# EAGLE design w18-CV-v03(rev5_6) (EAGLE 6.6.0)
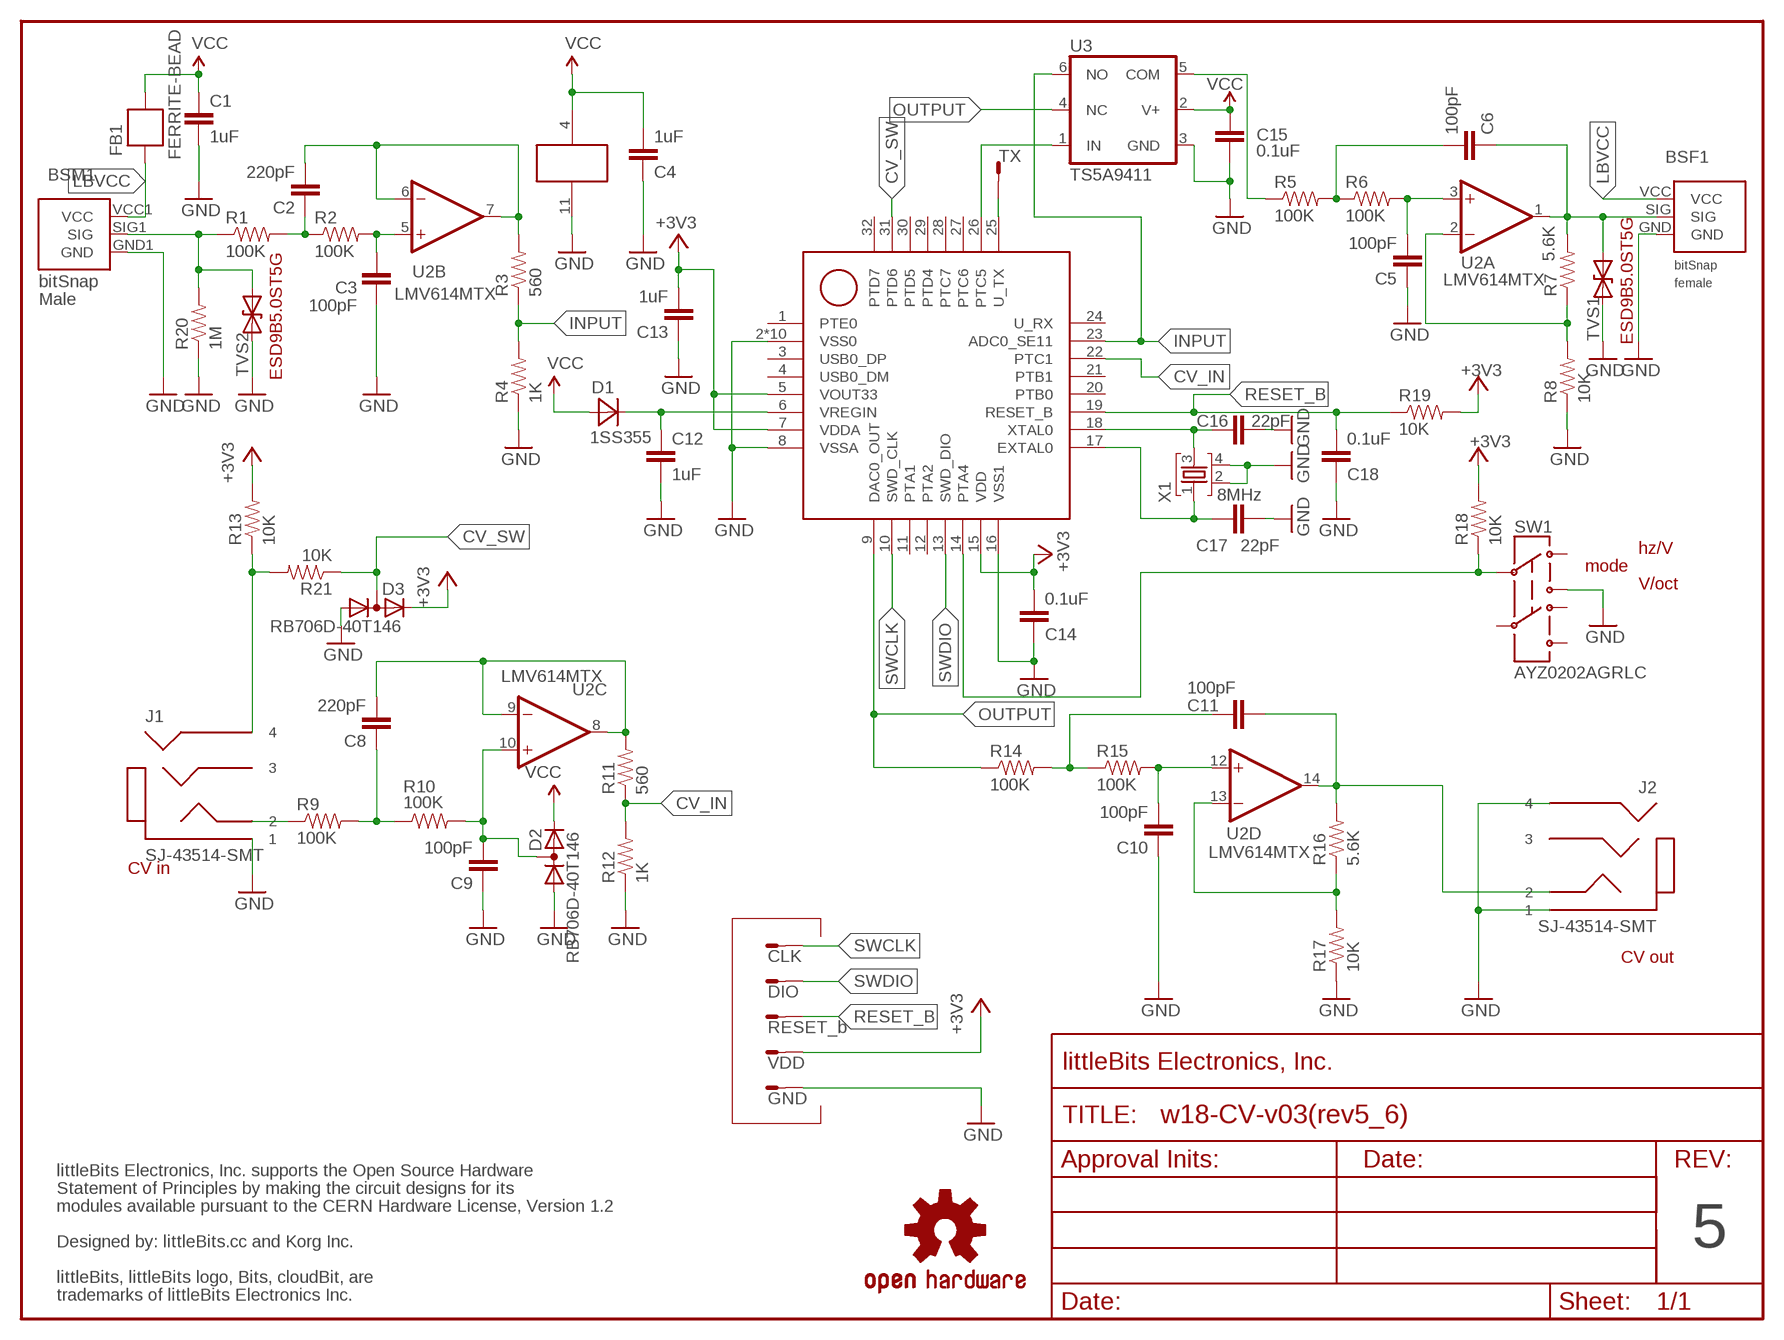
[diagram p0: schematic, sheet 1]

## Parts
BSF1  BITSNAP_V03_FEMALE  [BITSNAP_V03_FEMALE]
BSM1  BITSNAP_V03_MALE  [BITSNAP_V03_MALE]
C1  1uF  CC_1608_0.8_TBR_LB_1  [CC_1608_0.8_TBR_LB_1PRIMARY]
C2  220pF  CC_1608_0.8_TBR_LB_1  [CC_1608_0.8_TBR_LB_1PRIMARY]
C3  100pF  CC_1608_0.8_TBR_LB_1  [CC_1608_0.8_TBR_LB_1PRIMARY]
C4  1uF  CC_1608_0.8_TBR_LB_1  [CC_1608_0.8_TBR_LB_1PRIMARY]
C5  100pF  CC_1608_0.8_TBR_LB_1  [CC_1608_0.8_TBR_LB_1PRIMARY]
C6  100pF  CC_1608_0.8_TBR_LB_1  [CC_1608_0.8_TBR_LB_1PRIMARY]
C8  220pF  CC_1608_0.8_TBR_LB_1  [CC_1608_0.8_TBR_LB_1PRIMARY]
C9  100pF  CC_1608_0.8_TBR_LB_1  [CC_1608_0.8_TBR_LB_1PRIMARY]
C10  100pF  CC_1608_0.8_TBR_LB_1  [CC_1608_0.8_TBR_LB_1PRIMARY]
C11  100pF  CC_1608_0.8_TBR_LB_1  [CC_1608_0.8_TBR_LB_1PRIMARY]
C12  1uF  CC_1608_0.8_TBR_LB_1  [CC_1608_0.8_TBR_LB_1PRIMARY]
C13  1uF  CC_1608_0.8_TBR_LB_1  [CC_1608_0.8_TBR_LB_1PRIMARY]
C14  0.1uF  CC_1608_0.8_TBR_LB_1  [CC_1608_0.8_TBR_LB_1PRIMARY]
C15  0.1uF  CC_1608_0.8_TBR_LB_1  [CC_1608_0.8_TBR_LB_1PRIMARY]
C16  22pF  CC_1608_0.8_TBR_LB_1  [CC_1608_0.8_TBR_LB_1PRIMARY]
C17  22pF  CC_1608_0.8_TBR_LB_1  [CC_1608_0.8_TBR_LB_1PRIMARY]
C18  0.1uF  CC_1608_0.8_TBR_LB_1  [CC_1608_0.8_TBR_LB_1PRIMARY]
D1  1SS355  DISC_ROHM-UMD2_#_TBR_LB_1  [DISC_ROHM-UMD2_#_TBR_LB_1PRIMARY]
D2  RB706D-40T146  DIODE_SERIES_A1-K2-AK3_  [SOT23C]
D3  RB706D-40T146  DIODE_SERIES_A1-K2-AK3_  [SOT23C]
FB1  FERRITE-BEAD  [R0603]
FRAME1  FRAME-LETTER-OHWOHW  [FABDWG01-OHW]
J1  SJ-43514-SMT  LB_K_CN_SJ-43514-SMT_LB  [LB_K_CN_SJ-43514-SMT_LB]
J2  SJ-43514-SMT  LB_K_CN_SJ-43514-SMT_LB  [LB_K_CN_SJ-43514-SMT_LB]
JP1  GND  TEST_POINT_1  [TEST_POINT_1PRIMARY]
JP2  VDD  TEST_POINT_1  [TEST_POINT_1PRIMARY]
JP3  RESET_b  TEST_POINT_1  [TEST_POINT_1PRIMARY]
JP4  DIO  TEST_POINT_1  [TEST_POINT_1PRIMARY]
JP5  CLK  TEST_POINT_1  [TEST_POINT_1PRIMARY]
JP6  TX  TEST_POINT_1  [TEST_POINT_1PRIMARY]
R1  100K  R_1608_LB  [R_1608_LB]
R2  100K  R_1608_LB  [R_1608_LB]
R3  560  R_1608_LB  [R_1608_LB]
R4  1K  R_1608_LB  [R_1608_LB]
R5  100K  R_1608_LB  [R_1608_LB]
R6  100K  R_1608_LB  [R_1608_LB]
R7  5.6K  R_1608_LB  [R_1608_LB]
R8  10K  R_1608_LB  [R_1608_LB]
R9  100K  R_1608_LB  [R_1608_LB]
R10  100K  R_1608_LB  [R_1608_LB]
R11  560  R_1608_LB  [R_1608_LB]
R12  1K  R_1608_LB  [R_1608_LB]
R13  10K  R_1608_LB  [R_1608_LB]
R14  100K  R_1608_LB  [R_1608_LB]
R15  100K  R_1608_LB  [R_1608_LB]
R16  5.6K  R_1608_LB  [R_1608_LB]
R17  10K  R_1608_LB  [R_1608_LB]
R18  10K  R_1608_LB  [R_1608_LB]
R19  10K  R_1608_LB  [R_1608_LB]
R20  1M  R_1608_LB  [R_1608_LB]
R21  10K  R_1608_LB  [R_1608_LB]
SW1  AYZ0202AGRLC  SW_MS-22C01_#_TBR_LB_1  [SW_MS-22C01_#_TBR_LB_1PRIMARY]
TVS1  ESD9B5.0ST5G  DIODE-TVSSOD-923  [SOD-923]
TVS2  ESD9B5.0ST5G  DIODE-TVSSOD-923  [SOD-923]
U1  MKL26Z64VFM4  IC_TI-QFN32_0.5_TBR_LB_1  [IC_TI-QFN32_0.5_TBR_LB_1PRIMARY]
U2  LMV614MTX  IC_TSSOP14-225_0.65_TBR_LB_1  [IC_TSSOP14-225_0.65_TBR_LB_1PRIMARY]
U3  TS5A9411  IC_SSOP6-W2.1_0.65_TBR_LB_1  [IC_SSOP6-W2.1_0.65_TBR_LB_1PRIMARY]
U$1  OSHWCREDIT-KORG  [OSHWCREDIT-KORG]
U$5  OSHW-LOGOL  [OSHW-LOGO-L]
X1  8MHz  X_ROSON_RT5_#_TBR_LB_1  [X_ROSON_RT5_#_TBR_LB_1PRIMARY]

## Nets
+3V3: C13.2 C14.2 D3.2(K) JP2.1(S) R13.2 R18.2 R19.2 U1.5(VOUT33) U1.7(VDDA) U1.15(VDD)
CV_IN: R11.1 R12.2 U1.22(PTC1)
CV_SW: D3.3(AK) R21.1 U1.31(PTD6)
GND: BSF1.GND BSM1.GND1(GND) C1.2 C3.1 C4.1 C5.1 C9.1 C10.1 C12.2 C13.1 C14.1 C15.1 C16.1 C17.1 C18.1 D2.1(A) D3.1(A) J1.1 J2.1 J2.4 JP1.1(S) R4.1 R8.1 R12.1 R17.1 R20.1 SW1.3 TVS1.1(A) TVS2.1(A) U1.2(VSS0) U1.8(VSSA) U1.16(VSS1) U1.33(VSS0) U1.34(VSS0) U1.35(VSS0) U1.36(VSS0) U1.37(VSS0) U1.38(VSS0) U1.39(VSS0) U1.40(VSS0) U1.41(VSS0) U2.11(P:V-) U3.3(GND) X1.2 X1.4
INPUT: R3.1 R4.2 U1.23(ADC0_SE11) U3.6(NO)
JCK_DET: J1.4 R13.1 R21.2
LBVCC: BSF1.VCC BSM1.VCC1(VCC) FB1.2
N$1: BSM1.SIG1(SIG) R1.1 R20.2 TVS2.2(C)
N$2: C2.2 R3.2 U2.6(B:-IN) U2.7(B:OUT)
N$3: C3.2 R2.2 U2.5(B:+IN)
N$4: C2.1 R1.2 R2.1
N$5: R5.1 U3.5(COM)
N$6: BSF1.SIG C6.1 R7.2 TVS1.2(C) U2.1(A:OUT)
N$7: J1.2 R9.1
N$8: C12.1 D1.2 U1.6(VREGIN)
N$9: C6.2 R5.2 R6.1
N$10: C5.2 R6.2 U2.3(A:+IN)
N$11: R18.1 SW1.2 U1.14(PTA4)
N$12: C9.2 D2.3(AK) R10.2 U2.10(C:+IN)
N$13: C8.1 R9.2 R10.1
N$14: U1.26(PTC5) U3.1(IN)
N$15: C17.2 U1.17(EXTAL0) X1.1
N$16: C16.2 U1.18(XTAL0) X1.3
N$18: C11.2 R14.2 R15.1
N$19: C10.2 R15.2 U2.12(D:+IN)
N$20: R7.1 R8.2 U2.2(A:-IN)
N$21: C11.1 J2.2 R16.2 U2.14(D:OUT)
N$22: R16.1 R17.2 U2.13(D:-IN)
NETR: C8.2 R11.2 U2.8(C:OUT) U2.9(C:-IN)
OUTPUT: R14.1 U1.9(DAC0_OUT) U3.4(NC)
RESET_B: C18.2 JP3.1(S) R19.1 U1.19(RESET_B)
SWCLK: JP5.1(S) U1.10(SWD_CLK)
SWDIO: JP4.1(S) U1.13(SWD_DIO)
TX: JP6.1(S) U1.25(U_TX)
VCC: C1.1 C4.2 C15.2 D1.1 D2.2(K) FB1.1 U2.4(P:V+) U3.2(V+)
Unconnected: J1.3 J2.3 SW1.1 SW1.4 SW1.5 SW1.6 U1.1(PTE0) U1.3(USB0_DP) U1.4(USB0_DM) U1.11(PTA1) U1.12(PTA2) U1.20(PTB0) U1.21(PTB1) U1.24(U_RX) U1.27(PTC6) U1.28(PTC7) U1.29(PTD4) U1.30(PTD5) U1.32(PTD7)

## Notes on the sheet
- hz/V
- mode
- V/oct
- CV in
- CV out
- 5

## Library data of the parts
BSF1 = bitSnap:BITSNAP_V03_FEMALE
BSM1 = bitSnap:BITSNAP_V03_MALE
C1-C6 C8-C18 = LB_K:CC_1608_0.8_TBR_LB_1
D1 = LB_K:DISC_ROHM-UMD2_#_TBR_LB_1
D2 D3 = LITTLEBITS:DIODE_SERIES_A1-K2-AK3: DUAL DIODE
FB1 = LITTLEBITS:FERRITE-BEAD
FRAME1 = LITTLEBITS:FRAME-LETTER-OHW
J1 J2 = LITTLEBITS:LB_K_CN_SJ-43514-SMT_LB
JP1-JP6 = LB_K:TEST_POINT_1
R1-R21 = LB_K:R_1608_LB
SW1 = LB_K:SW_MS-22C01_#_TBR_LB_1
TVS1 TVS2 = LITTLEBITS:DIODE-TVS: Bidirectional Transient Voltage Suppression Diode: Device conducts in avalanche mode after reaching a part dependent voltage threshold. Used for limiting voltage spikes on ESD sensitive inputs and outputs.; IEC_ESD_PROT0: +/-18kV; LB_PN: ?; MPN: ESD9B5.0ST5G; V_CLAMP: ?; V_OPERATION: 5V
U1 = LB_K:IC_TI-QFN32_0.5_TBR_LB_1
U2 = LB_K:IC_TSSOP14-225_0.65_TBR_LB_1
U3 = LB_K:IC_SSOP6-W2.1_0.65_TBR_LB_1
U$1 = LITTLEBITS:OSHWCREDIT-KORG
U$5 = LITTLEBITS:OSHW-LOGO: Open Source Hardware Logo This logo indicates the piece of hardware it is found on incorporates a OSHW license and/or adheres to the definition of open source hardware found here: http://freedomdefined.org/OSHW
X1 = LB_K:X_ROSON_RT5_#_TBR_LB_1

## Board
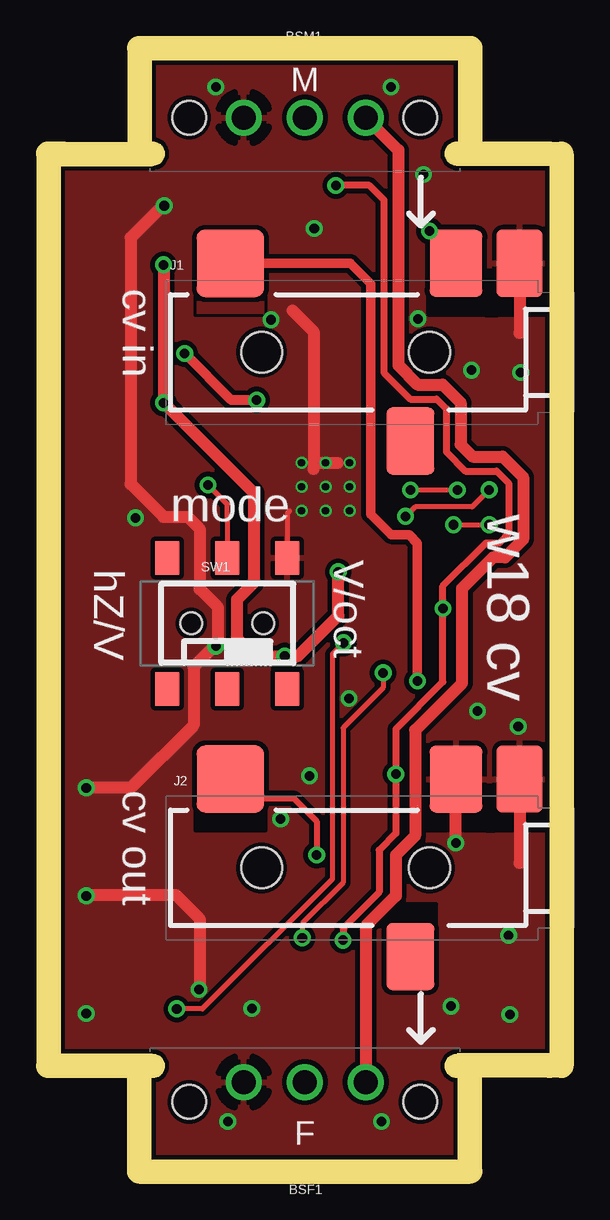
[diagram p1: board, top side]
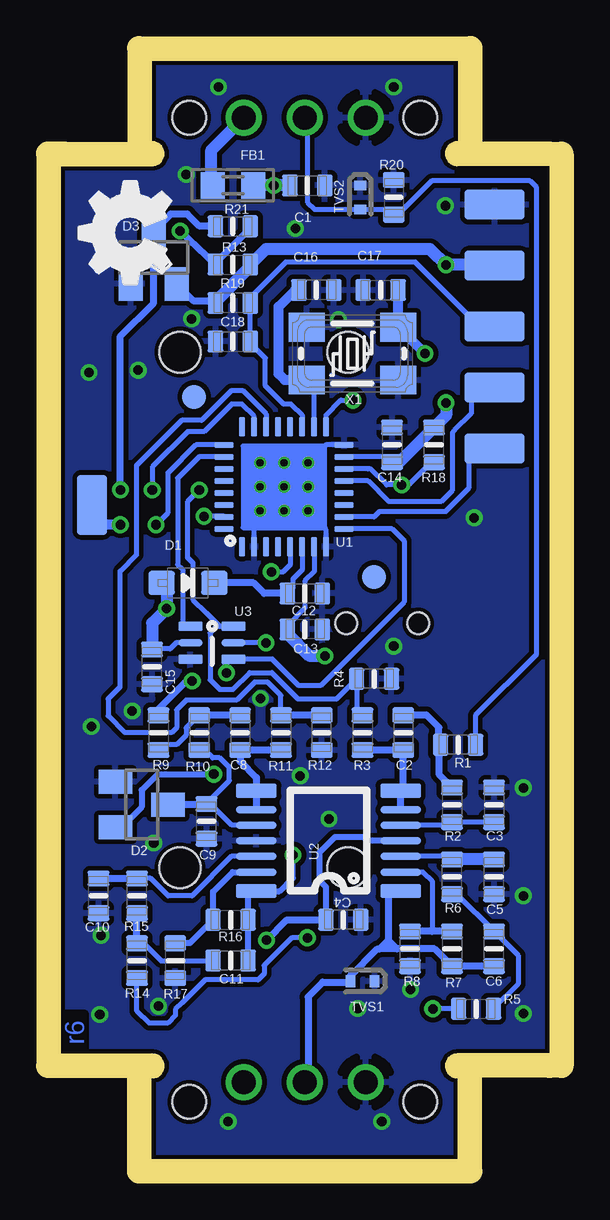
[diagram p2: board, bottom side, seen from below]

Size 20.4 x 45.81 mm. Coordinates in mm from the lower left corner, seen from the top.
Outline: 20.4,41.41 20.4,4.4
Outline: 0,41.41 0,4.4
Copper layers (1*16): Top 0.035mm / dielectric 1.5mm / Bottom 0.035mm
Design rules "littleBitsDRC": minimum track width 0.2mm, minimum drill 0.2mm, track to track 0.2mm, track to pad 0.2mm, pad to pad 0.2mm, via to via 0.2mm, smd to smd 0mil, copper to edge 0.2mm, drill to drill 0.2mm, minimum pad ring 0.1mm, minimum via ring 0.15mm, stop-mask expansion 0.1mm, vias tented up to drill 0.5mm, thermal gap 0.2mm
tRestrict: area 17.7,36.7 to 18,37; area 17.8,15.3 to 18,15.6; area 17.8,13.7 to 18.1,14.6; 8 lines
bRestrict: 2 lines
Milling: 6 lines

### Footprints (pad centres in the part's own frame; a part is rotated, then mirrored left to right if it is on the bottom)
BITSNAP_V03_FEMALE = drill 1: GND 4.065,3.44; SIG 6.605,3.44; VCC 9.145,3.44 | hole 1.4: 1.785,2.61; 11.425,2.61
BITSNAP_V03_MALE = drill 1: GND1 9.145,2.61; SIG1 6.605,2.61; VCC1 4.065,2.61 | hole 1.4: 1.785,2.61; 11.425,2.61
CC_1608_0.8_TBR_LB_1PRIMARY = smd 0.65 x 0.9: 1 -0.725,0; 2 0.725,0
DISC_ROHM-UMD2_#_TBR_LB_1PRIMARY = smd 1.1 x 1: 1 -1.1,0; 2 1.1,0
SOT23C = smd 1 x 1.4: 1 -0.95,-1.1; 2 0.95,-1.1; 3 0,1.1
R0603 = smd 1 x 1.1: 1 -0.85,0; 2 0.85,0
LB_K_CN_SJ-43514-SMT_LB = smd 2.8 x 1.9: 1 -3.7,-0.75 | smd 2.8 x 2.8: 2 -3.7,-12.8 | smd 2.8 x 2: 3 3.7,-5.3 | smd 2.8 x 2.2: 4 -3.7,-3.4 | hole 1.7: 0,-4.5; 0,-11.5
TEST_POINT_1PRIMARY = smd 1.25 x 2.5: 1 0,0
R_1608_LB = smd 0.65 x 0.9: 1 -0.725,0; 2 0.725,0
SW_MS-22C01_#_TBR_LB_1PRIMARY = smd 1.4 x 1: 1 2.725,2.5; 2 2.725,0; 3 2.725,-2.5; 4 -2.725,2.5; 5 -2.725,0; 6 -2.725,-2.5 | hole 0.9: 0,1.5; 0,-1.5
SOD-923 = smd 0.4 x 0.5: 1 -0.5,0; 2 0.5,0
IC_TI-QFN32_0.5_TBR_LB_1PRIMARY = smd 0.8 x 0.24: 1 -2.5,1.75; 2 -2.5,1.25; 3 -2.5,0.75; 4 -2.5,0.25; 5 -2.5,-0.25; 6 -2.5,-0.75; 7 -2.5,-1.25; 8 -2.5,-1.75; 17 2.5,-1.75; 18 2.5,-1.25; 19 2.5,-0.75; 20 2.5,-0.25; 21 2.5,0.25; 22 2.5,0.75; 23 2.5,1.25; 24 2.5,1.75 | smd 0.24 x 0.8: 9 -1.75,-2.5; 10 -1.25,-2.5; 11 -0.75,-2.5; 12 -0.25,-2.5; 13 0.25,-2.5; 14 0.75,-2.5; 15 1.25,-2.5; 16 1.75,-2.5; 25 1.75,2.5; 26 1.25,2.5; 27 0.75,2.5; 28 0.25,2.5; 29 -0.25,2.5; 30 -0.75,2.5; 31 -1.25,2.5; 32 -1.75,2.5 | drill 0.3 pad 0.5: 33 -1,1; 34 0,1; 35 1,1; 36 -1,0; 37 0,0; 38 1,0; 39 -1,-1; 40 0,-1; 41 1,-1 | smd 1 x 1: 42 -3.75,-3.75; 43 3.75,3.75
IC_TSSOP14-225_0.65_TBR_LB_1PRIMARY = smd 0.6 x 1.7: 1 -2.09,-3.007; 7 2.09,-3.007; 8 2.09,3.007; 14 -2.09,3.007 | smd 0.32 x 1.7: 2 -1.3,-3.007; 3 -0.65,-3.007; 4 0,-3.007; 5 0.65,-3.007; 6 1.3,-3.007; 9 1.3,3.007; 10 0.65,3.007; 11 0,3.007; 12 -0.65,3.007; 13 -1.3,3.007
IC_SSOP6-W2.1_0.65_TBR_LB_1PRIMARY = smd 0.385 x 1: 1 -0.682,-0.9; 3 0.682,-0.9; 4 0.682,0.9; 6 -0.682,0.9 | smd 0.32 x 1: 2 0,-0.9; 5 0,0.9
X_ROSON_RT5_#_TBR_LB_1PRIMARY = smd 1.5 x 1.2: 1 -1.9,-1.1; 2 1.9,-1.1; 3 1.9,1.1; 4 -1.9,1.1

### Placement (x,y rotation side)
BSF1  3.6,-0.21 0 top
BSM1  16.8,46.02 180 top
C1  10.1,40.59 0 bottom
C2  6.1,17.79 270 bottom
C3  2.32,14.78 270 bottom
C4  8.6,9.99 180 bottom
C5  2.32,11.78 90 bottom
C6  2.32,8.78 90 bottom
C8  12.9,17.79 270 bottom
C9  14.29,14.09 90 bottom
C10  18.79,10.99 90 bottom
C11  13.29,8.29 180 bottom
C12  10.2,23.59 0 bottom
C13  10.2,22.09 180 bottom
C14  6.57,29.78 270 bottom
C15  16.57,20.53 90 bottom
C16  9.71,36.23 180 bottom
C17  7.04,36.23 0 bottom
C18  13.2,34.09 0 bottom
D1  15.07,24.03 0 bottom
D2  17,14.79 270 bottom
D3  16.5,37.59 0 bottom
E$30  [OSHW_FILLX150_NOTEXT]  15.79,36.49 90 bottom
FB1  13.2,40.59 180 bottom
FRAME1  3.6,-0.21 0 top
J1  19.9,33.64 270 top
J2  19.9,12.16 270 top
JP1  2.29,39.78 270 bottom
JP2  2.29,37.24 270 bottom
JP3  2.29,34.7 270 bottom
JP4  2.29,32.16 270 bottom
JP5  2.29,29.62 90 bottom
JP6  19.07,27.28 180 bottom
R1  3.82,17.28 180 bottom
R2  4.07,14.78 270 bottom
R3  7.79,17.79 270 bottom
R4  7.32,20.03 180 bottom
R5  3.07,6.28 0 bottom
R6  4.07,11.78 90 bottom
R7  4.07,8.78 270 bottom
R8  5.82,8.78 90 bottom
R9  16.29,17.79 270 bottom
R10  14.6,17.79 270 bottom
R11  11.2,17.79 270 bottom
R12  9.5,17.79 90 bottom
R13  13.2,37.29 0 bottom
R14  17.2,8.29 90 bottom
R15  17.2,10.99 90 bottom
R16  13.29,9.99 0 bottom
R17  15.6,8.29 90 bottom
R18  4.82,29.78 90 bottom
R19  13.2,35.69 180 bottom
R20  6.5,40.09 270 bottom
R21  13.2,38.89 0 bottom
SW1  6.97,22.34 90 top
TVS1  7.79,7.44 180 bottom
TVS2  7.89,40.09 270 bottom
U1  11.06,28.03 90 bottom
U2  9.21,13.28 90 bottom
U3  14.07,21.53 270 bottom
U$1  -74.5,-73.31 0 top  (outside the outline)
U$5  -21.57,-70.94 0 top  (outside the outline)
X1  8.21,33.58 180 bottom

### Tracks (layer width: path | path; a pad name or v marks a point on that pad's centre or on a via)
+3V3  (via drill 0.4, 0.4 pad 0.6)
  Top 0.5: v4.32,37.28 v4.32,31.53 8.06,27.78 8.06,24.03 7.37,23.33 7.37,21.73 8.12,20.98 v9.37,20.98 9.92,20.98 11.6,22.66 v11.6,24.49
  Bottom 0.2: 6.57,29.28 U1.15 | U1.5 10.81,24.78 11.11,24.49 v11.6,24.49 | U1.7 9.81,24.49 10.2,24.11 10.2,22.99 10.92,22.27 C13.2 | 11.12,22.16 C13.2 | 10.92,22.2 C13.2
  Bottom 0.203: 6.23,29.09 6.35,29.21 C14.2 6.57,29.28 | 4.96,30.36 5.08,30.48 R18.2 | JP2.1 2.33,37.24 2.33,37.28 | 11.04,22.03 C13.2 | U1.15 | U1.5 | U1.7
  Bottom 0.3: 13.92,35.77 14.82,35.77 D3.2
  Bottom 0.5: C14.2 6.27,29.05 6.23,29.09 4.96,30.36 4.32,31 v4.32,31.53 | 2.33,37.28 v4.32,37.28 4.97,37.94 11.82,37.94 R13.2 12.47,37.21 13.92,35.77 R19.2 | v9.37,20.98 9.98,20.98 10.92,21.91 C13.2
CV_IN
  Bottom 0.2: U1.22 11.82,31.07 12.78,32.03 13.27,32.03 14.5,30.8 15.34,30.8 17.22,28.91 17.22,25.2 17.89,24.52 17.89,19.7 18.39,19.2 18.39,18.49 17.7,17.79 15.75,17.79 15.54,17.99 15.54,18.74 15.15,19.14 13.04,19.14 12.29,19.89 11.75,19.89 11.2,19.34 R11.1
  Bottom 0.3: 9.59,18.5 9.56,18.53 9.55,18.52 R12.2 R11.1
CV_SW  (via drill 0.4 pad 0.6)
  Top 0.2: v14.4,26.8 14.8,27.2 17.18,27.2 v17.88,27.9
  Bottom 0.2: U1.31 13.57,26.8 v14.4,26.8
  Bottom 0.203: U1.31
  Bottom 0.3: v17.88,27.9 17.88,34.3 16.5,35.69 D3.3 15.79,39.39 15.1,39.39 14.6,38.89 R21.1
GND  (via drill 0.4)
  Top 0.2: 9.56,27.03 9.47,26.93 9.47,25.05 9.5,25.05
  Top 0.5: 1.07,11.03 4.82,11.03 5.82,10.03 5.82,7.03 | 4.32,39.78 2.95,38.41 2.95,28.15 4.32,26.78 5.32,26.78 5.82,26.28 5.82,23.78 6.57,23.03 6.57,21.53 5.57,20.53 5.57,18.1 2.97,15.5 1.09,15.5 | 10.56,29.03 10.56,34.5 9.69,35.38 | 10.56,29.03 10.56,28.78 | 10.56,29.03 11.56,29.03 | 19.32,37.41 19.15,37.3 | J2.1 19.15,12.35 | J1.1 19.15,34.45 19.14,34.44 | v16.5,13.19 16.5,15.89
  Bottom 0.2: U1.2 12.32,26.78 U1.33 | U1.8 9.31,26.24 9.54,26.46 9.54,27 9.56,27.03 9.56,27.53 U1.40 | U1.16 9.31,29.78 U1.41
  other vias: 17.14,32.89 17.39,18.69 16.29,6.39 4.35,39.74 12.04,19.21 10.39,15.99 9.2,14.19 8,6.29 1.1,6.09 1.1,10.99 1.1,15.49 19.09,18.04 19.2,32.79 3.15,26.74 10.6,38.79 15.15,41.04 18.7,9.34 18.75,6.04 7,1.59 13.4,1.59 5.79,7.09 6.5,44.69 13.79,44.69 6.5,21.39 8.79,34.99 14.92,35.03
  pour Top (no thermals): 9.56,29.53 9.56,26.53 12.57,26.53 12.57,29.53
  pour Top: 3.8,45.81 16.6,45.81 16.6,41.41 20.4,41.41 20.4,4.4 16.6,4.4 16.6,0 3.8,0 3.8,4.4 0,4.4 0,41.41 3.8,41.41
  pour Bottom: 3.8,45.81 16.6,45.81 16.6,41.41 20.4,41.41 20.4,4.4 16.6,4.4 16.6,0 3.8,0 3.8,4.4 0,4.4 0,41.41 3.8,41.41
INPUT  (via drill 0.4 pad 0.6)
  Top 0.203: v14.6,27.9 v16.55,27.9
  Bottom 0.2: R4.2 8.88,19.19 10.47,19.19 11.58,20.29 12.5,20.29 13.2,19.59 13.75,19.59 14.15,19.99 14.15,21.95 14.07,22.03 | v14.6,27.9 15.1,27.4 15.1,25.09 14.87,24.86 14.87,23.33 | U1.23 12.32,30.97 12.83,31.48 13.25,31.48 14.4,30.33 15.09,30.33 16.55,28.86 v16.55,27.9 | 14.32,22.78 13.75,22.21 U3.6
  Bottom 0.203: R4.2 | R4.2 8.04,18.73 R3.1 | U3.6 13.88,22.21 14.07,22.03 | 14.87,23.33 14.32,22.78
JCK_DET  (via drill 0.4)
  Top 0.3: v15.4,38.69 16.45,37.29 J1.4
  Bottom 0.3: R21.2 12.47,38.81 13.92,37.37 R13.1 v15.4,38.69
LBVCC
  Top 0.5: BSM1.VCC1 14.1,42.06 14.1,33.09 14.9,32.29 15.95,32.29 16.7,31.54 16.7,29.79 17.2,29.29 18.45,29.29 19.29,28.44 19.29,25.84 18.54,25.09 18.04,25.09 16.75,23.8 16.75,19.85 14.79,17.89 14.79,13.49 14,12.69 14,10.99 12.74,9.73 BSF1.VCC
  Bottom 0.5: FB1.2 14.1,40.64 14.1,42.06 BSM1.VCC1
N$1
  Bottom 0.2: R1.1 3.09,18.5 0.57,21.03 0.57,40.53 0.82,40.78 4.91,40.78 6.32,39.37 R20.2 6.72,39.59 TVS2.2 9.79,39.59 10.1,39.89 10.1,43.31 BSM1.SIG1
N$2
  Bottom 0.2: 6.27,14.58 6.31,14.58
  Bottom 0.203: U2.6 6.27,14.58 | 6.27,14.58
  Bottom 0.3: U2.6 U2.7 6.1,15.48 C2.2 R3.2
N$3
  Bottom 0.2: C3.2 R2.2 4.19,13.93 U2.5
N$4
  Bottom 0.2: 4.62,17.05 4.54,16.98 | R2.1
  Bottom 0.203: R2.1 4.07,15.53 | R1.2 4.62,17.28
  Bottom 0.3: 4.62,17.28 4.62,18.01 5.12,18.52 C2.1 | R2.1 4.62,16.05 4.62,17.05 4.62,17.2 R1.2
N$5  (via drill 0.4 pad 0.6)
  Top 0.2: v11.82,21.53 11.35,21.06 11.35,11.69 5.94,6.28 v4.87,6.28
  Bottom 0.2: R5.1 v4.87,6.28 | v11.82,21.53 U3.5
N$6
  Bottom 0.203: BSF1.SIG 10.16,3.81 10.06,3.81 | 6.31,11.19 U2.1
  Bottom 0.3: C6.1 R7.2 4.79,8.78 6.37,8.78 | 6.31,11.19 6.72,11.19 6.72,9.14 | 10.17,3.22 10.06,3.33 10.06,3.81 10.06,6.78 9.46,7.39 8.35,7.39 TVS1.2 8.29,7.67 7.18,8.78 7.09,8.78 | 6.72,9.14 6.37,8.78 | 6.72,9.14 7.09,8.78 | 6.37,8.78 7.09,8.78
N$7  (via drill 0.4)
  Top 0.4: J1.2 12.1,37.34 12.95,36.49 12.95,26.89 13.79,26.04 14.54,26.04 14.9,25.69 v14.9,19.94
  Bottom 0.3: v14.9,19.94 15.13,19.94 16.34,18.73 R9.1
N$8
  Bottom 0.2: U1.6 10.31,24.57 10.7,24.19 10.7,23.81 C12.1
  Bottom 0.203: U1.6
  Bottom 0.3: C12.1 11.9,23.59 12.34,24.03 D1.2
N$9
  Bottom 0.2: R6.1 3.87,11.05 C6.2 1.32,8.5 1.32,7.3 R5.2
  Bottom 0.203: C6.2
N$10
  Bottom 0.2: 6.31,12.63 4.19,12.63 R6.2
  Bottom 0.203: C5.2 2.54,12.7 2.54,12.5 | 3.81,12.5 3.81,12.7 R6.2 | 6.31,12.63 U2.3
  Bottom 0.5: C5.2 2.54,12.5 3.81,12.5 R6.2
N$11  (via drill 0.4 pad 0.6)
  Top 0.2: 6.97,26.62 6.97,27.3 v6.17,28.11
  Top 0.203: 6.97,26.62 SW1.2 6.97,25.05 6.9,25.05
  Bottom 0.2: 7.57,28.78 7.46,28.78 6.79,28.11 v6.17,28.11 5.88,28.11 4.93,29.05 R18.1
  Bottom 0.203: 7.57,28.78 U1.14 | 4.91,29.05 R18.1 4.91,29.05 | 4.91,29.05 4.94,29.05 | 4.91,29.05 | U1.14
N$12
  Bottom 0.2: U2.10 13.24,13.93 14.12,14.81 14.17,14.81 | C9.2 14.17,14.81 | 14.17,14.81 14.17,14.96 13.35,15.79 13.35,16.34 13.75,16.74 14.04,16.74 14.37,17.06 R10.2
  Bottom 0.3: C9.2 14.32,14.79 D2.3
N$13
  Bottom 0.2: R10.1 14.62,18.52 15.15,17.99 15.15,17.69 15.54,17.29 16.07,17.29 R9.2
  Bottom 0.3: C8.1 R10.1
N$14
  Bottom 0.2: U1.26 14.61,29.28 15.5,28.39 15.5,24.79 15.29,24.59 15.29,22.21 U3.1
  Bottom 0.203: U1.26
N$15  (via drill 0.4)
  Top 0.406: v8.2,31.64 7.14,31.64 v5.2,33.59
  Bottom 0.2: U1.17 9.31,31.02 8.7,31.64 v8.2,31.64 | X1.1 6.29,34.68
  Bottom 0.203: 6.57,34.48 6.57,34.68 6.19,34.3 5.75,34.3 5.75,34.34 X1.1 6.49,34.85 | U1.17
  Bottom 0.406: C17.2 X1.1 | 6.29,34.68 v5.2,33.59
N$16
  Bottom 0.2: U1.18 9.81,32.18 X1.3
  Bottom 0.203: 9.71,32.33 10.12,32.33 | 10.21,32.33 10.12,32.33 | 10.12,32.33 X1.3 | U1.18
  Bottom 0.406: 10.45,36.24 C16.2 10.61,36.23 11.29,35.54 11.29,32.74 11.04,32.49 X1.3
N$18
  Bottom 0.2: 17.12,9.01 R14.2 16.92,9.01 16.18,8.28 14.03,8.28 C11.2
  Bottom 0.3: R14.2 R15.1
N$19
  Bottom 0.2: U2.12 13.26,12.63 14.9,10.99 15.9,10.99 16.62,11.71 R15.2
  Bottom 0.3: C10.2 R15.2
N$20
  Bottom 0.2: U2.2 5.27,11.98 4.9,11.61 4.9,9.5
  Bottom 0.203: R8.2 | R7.1
  Bottom 0.3: R7.1 4.9,9.5 R8.2
N$21  (via drill 0.4)
  Top 0.2: 7.1,15.05 J2.2
  Top 0.254: 7.1,15.05 9.73,15.05 10.7,14.09 v10.7,12.69
  Bottom 0.2: 12.32,11.19 12.48,11.03
  Bottom 0.203: 12.32,11.19 U2.14
  Bottom 0.254: C11.1 R16.2 12.57,10.94 12.48,11.03 | U2.14 11.25,11.19 10.7,11.74 v10.7,12.69
N$22
  Bottom 0.2: 15.54,9.03 15.57,9
  Bottom 0.203: 15.57,9 R17.2
  Bottom 0.254: 15.54,9.03 14.98,9.03 R16.1 14.02,11.16 13.21,11.98 U2.13
NETR
  Bottom 0.203: U2.9 12.32,14.58
  Bottom 0.3: R11.2 C8.2 12.9,16.59 12.22,15.92 U2.8 U2.9
OUTPUT  (via drill 0.4, 0.4 pad 0.6)
  Top 0.2: v13.46,20.28 13.46,19.66 11.79,17.99 11.79,11.54 10.1,9.84 v10.1,9.24
  Bottom 0.2: U1.9 6.57,26.28 6.07,25.78 6.07,23.23 9.53,19.77 10.47,19.77 11.55,20.85 U3.4 | R14.1 17.2,6.19 16.68,5.68 15.92,5.68 15.59,6 15.59,6.25 15.32,6.53 14.36,7.49 12.15,7.49 11.9,7.74 11.9,8.09 10.75,9.24 v10.1,9.24
  Bottom 0.203: U3.4 13.32,20.85 | U1.9
  Bottom 0.3: v13.46,20.28 13.46,20.85 U3.4
RESET_B
  Bottom 0.2: U1.19 10.31,31.03 10.77,31.48 11.09,31.48 11.85,32.24 11.85,33.39 12.47,34.02 C18.2 | 3.24,34.7 JP3.1 2.29,35.2 3.41,35.2 5.6,37.39 11,37.39 12.47,35.91 R19.1 | 12.49,35.95 R19.1 | 12.5,35.78 R19.1 | 12.49,34.07 C18.2 | C18.2 R19.1 | 12.47,34.06 C18.2
  Bottom 0.203: U1.19
SWCLK
  Bottom 0.203: U1.10 7.32,26.78 7.1,27 4.35,27 3.35,27.99 3.35,29.6 3.33,29.62 JP5.1 | U1.10
SWDIO
  Bottom 0.2: 7.57,28.28 6.72,27.44 4.5,27.44 4.04,27.89 4.04,30.3 3.97,30.38
  Bottom 0.203: 7.57,28.28 U1.13 | 3.27,31.75 3.27,32.08 3.18,32.16 | 3.27,31.75 3.27,31.08 3.97,30.38 | JP4.1 2.54,31.75 3.27,31.75 | U1.13
TX  (via drill 0.4 pad 0.6)
  Top 0.203: v16.4,26.45 v17.88,26.45
  Bottom 0.2: U1.25 14.74,29.78 15.9,28.62 15.9,26.95 v16.4,26.45 | 19.32,27.28 19.32,26.53
  Bottom 0.203: 19.05,26.67 JP6.1 19.32,27.28 | 19.32,27.28 | U1.25
  Bottom 0.406: v17.88,26.45 19.05,26.45 19.05,26.67
VCC  (via drill 0.4, 0.4 pad 0.6)
  Top 0.3: v11.79,9.14 11.79,9.64 13.29,11.14 13.29,12.89 14,13.59 v14,16.06 14,17.94 15.96,19.9 v15.96,22.96 15.96,23.9 17.75,25.69 18.29,25.69 18.7,26.09 18.7,28.19 18.2,28.69 16.89,28.69 16.09,29.49 16.09,31.29 15.7,31.69 14.6,31.69 13.5,32.79 13.5,39.99 12.9,40.59 v11.5,40.59
  Bottom 0.2: C15.2 16.54,21.28 15.82,21.28 15.57,21.53 U3.2
  Bottom 0.203: 16.51,24.13 D1.1
  Bottom 0.254: U2.4 7.59,13.28 7.75,13.44 8.95,13.44 9.6,12.79 9.6,11.64 9.32,11.36 C4.2 | D2.2 17.75,14.19 17.5,14.19 17,14.69 17,15.39 16.32,16.06 v14,16.06
  Bottom 0.3: v11.79,9.14 10.95,9.99 C4.2
  Bottom 0.5: D1.1 15.96,23.82 v15.96,22.96 16.57,22.35 C15.2 | C1.1 v11.5,40.59 FB1.1

### Text on the board
Bottom: r6
tPlace: cv in | mode | w18 cv | hZ/V | V/oct | cv out
tNames: BSM1 | BSF1
dxf: 6 | Control Voltage Bit